# EAGLE design triac (EAGLE 8.6.0)

## Sheet 1 of 2
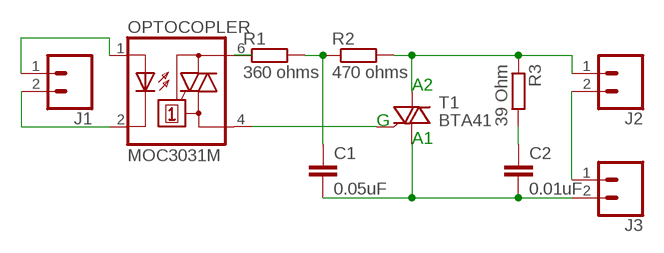
[diagram p0: schematic, sheet 1]

### Parts
C1  0.05uF  C7.5/3  [C7.5B3]
C2  0.01uF  C7.5/3  [C7.5B3]
J1  CONN_02JST-PTH-2  [JST-2-PTH]
J2  CONN_02JST-PTH-2  [JST-2-PTH]
J3  CONN_02JST-PTH-2  [JST-2-PTH]
OPTOCOPLER  MOC3031M  [DIL06]
R1  360 ohms  R-EU_0204/5  [0204/5]
R2  470 ohms  R-EU_0204/5  [0204/5]
R3  39 Ohm  R-EU_0204/5  [0204/5]
T1  BTA41  BT138-V  [TO220BV]

### Nets
N$1: J1.2 OPTOCOPLER.2(C)
N$2: J1.1 OPTOCOPLER.1(A)
N$3: OPTOCOPLER.6(A2) R1.1
N$4: C1.1 R1.2 R2.1
N$5: C1.2 C2.2 J3.2 T1.T1(A1)
N$6: OPTOCOPLER.4(A1) T1.G
N$7: J2.1 R2.2 R3.1 T1.T2(A2)
N$8: C2.1 R3.2
N$9: J2.2 J3.1

### Notes on the sheet
- A2
- G
- A1

## Sheet 2 of 2

## Library data of the parts
C1 C2 = capacitor-wima:C: CAPACITOR naming: grid - package width
J1-J3 = SparkFun-Connectors:CONN_02: Multi connection point. Often used as Generic Header-pin footprint for 0.1 inch spaced/style header connections On any of the 0.1 inch spaced packages, you can populate with these: Break Away Headers - Straight <https://www.sparkfun.com/products/116> (PRT-00116) Break Away Male Headers - Right Angle <https://www.sparkfun.com/products/553> (PRT-00553) Female Headers <https://www.sparkfun.com/products/115> (PRT-00115) Break Away Headers - Machine Pin <https://www.sparkfun.com/products/117> (PRT-00117) Break Away Female Headers - Swiss Machine Pin <https://www.sparkfun.com/products/743> (PRT-00743) For SCREWTERMINALS and SPRING TERMINALS visit here: Screw Terimnals on SparkFun.com <https://www.sparkfun.com/search/results?term=Screw+Terminals> (5mm/3.5mm/2.54mm spacing) This device is also useful as a general connection point to wire up your design to another part of your project. Our various solder wires solder well into these plated through hole pads. Hook-Up Wire - Assortment (Stranded, 22 AWG) <https://www.sparkfun.com/products/11375> (PRT-11375) Hook-Up Wire - Assortment (Solid Core, 22 AWG) <https://www.sparkfun.com/products/11367> (PRT-11367) View the entire wire category on our website here <https://www.sparkfun.com/categories/141> Special notes: Molex polarized connector foot print use with: PRT-08233 with associated crimp pins and housings. 2.54_SCREWTERM for use with PRT-10571. 3.5mm Screw Terminal footprints for PRT-08084 5mm Screw Terminal footprints for use with PRT-08432; PROD_ID: CONN-09863; SKU: PRT-09914
OPTOCOPLER = optocoupler:MOC30*: 6-Pin DIP Zero-Cross Optoisolators Triac Driver Output (250/400 Volt Peak) Source: Data sheet <http://www.fairchildsemi.com/ds/MO/MOC3031M.pdf> The old path of data sheet not more available 2013-05-06.; MF: FAIRCHILD SEMICONDUCTOR; MPN: MOC3031M; OC_FARNELL: 9875964; OC_NEWARK: 78K6089
R1-R3 = resistor:R-EU_: RESISTOR, European symbol
T1 = triac:BT138: TRIAC Source: http://www.semiconductors.philips.com BT138_SERIES_2.pdf

## Board
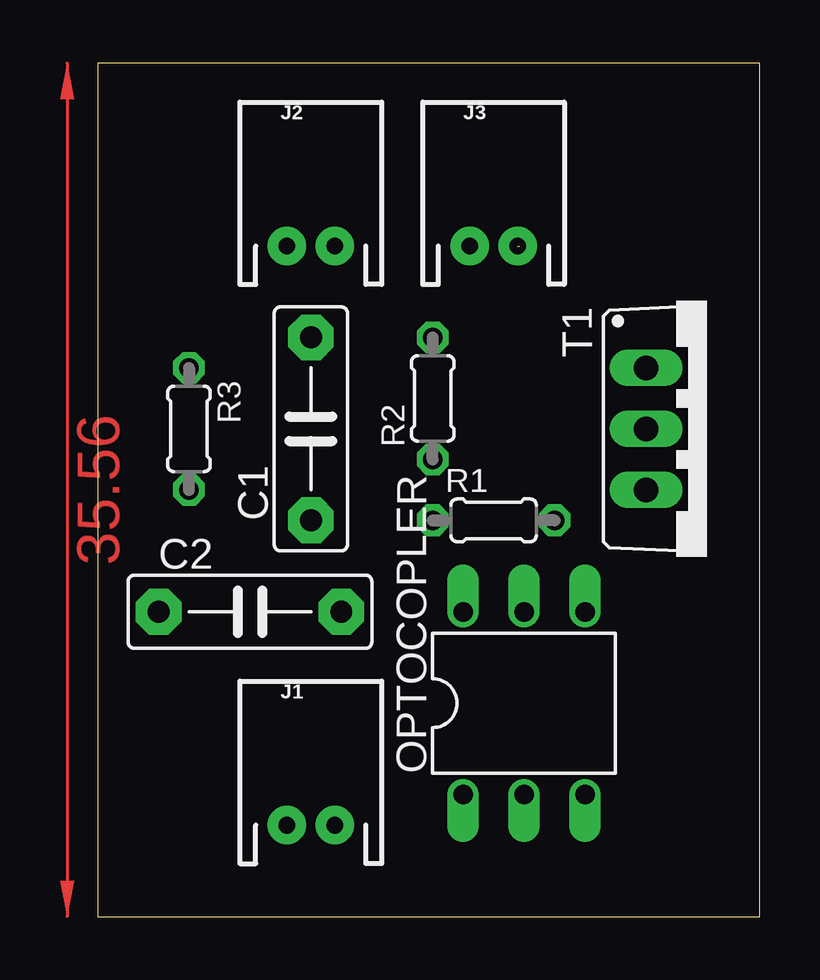
[diagram p1: board, top side]
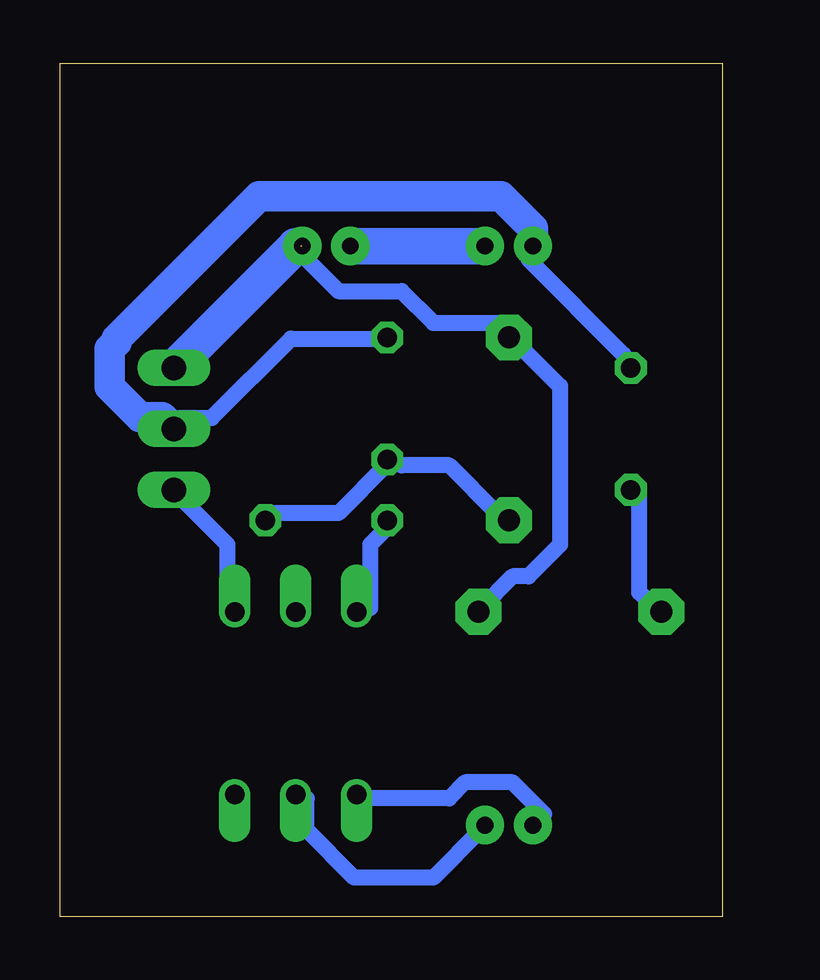
[diagram p2: board, bottom side, seen from below]

Size 27.61 x 35.55 mm. Coordinates in mm from the lower left corner, seen from the top.
Outline: 0,0 27.61,0 27.61,35.55 0,35.55 0,0
Copper layers (1*16): Top 0.035mm / dielectric 1.5mm / Bottom 0.035mm
Design rules "default *": minimum track width 26mil, minimum drill 0.35mm, track to track 26mil, track to pad 20mil, pad to pad 6mil, via to via 6mil, smd to smd 6mil, copper to edge 40mil, drill to drill 6mil, minimum pad ring 10mil, minimum via ring 8mil, stop-mask expansion 4mil, vias tented up to drill 0mil, thermal gap 10mil

### Footprints (pad centres in the part's own frame; a part is rotated, then mirrored left to right if it is on the bottom)
C7.5B3 = drill 0.914 pad 1.905 octagon: 1 -3.81,0; 2 3.81,0
JST-2-PTH = drill 0.7 pad 1.6: 1 -1,0; 2 1,0
DIL06 = drill 0.813 offset: 1 -2.54,-3.81; 2 0,-3.81; 3 2.54,-3.81; 4 2.54,3.81; 5 0,3.81; 6 -2.54,3.81
0204/5 = drill 0.813 octagon: 1 -2.54,0; 2 2.54,0
TO220BV = drill 1.016 long: G 2.54,-2.54; T1 -2.54,-2.54; T2 0,-2.54

### Placement (x,y rotation side)
C1  8.89,20.32 90 top
C2  6.35,12.7 0 top
J1  8.89,3.81 0 top
J2  8.89,27.94 0 top
J3  16.51,27.94 0 top
OPTOCOPLER  17.78,8.89 0 top
R1  16.51,16.51 0 top
R2  13.97,21.59 90 top
R3  3.81,20.32 270 top
T1  25.4,20.32 270 top

### Tracks (layer width: path | path; a pad name or v marks a point on that pad's centre or on a via)
N$1
  Bottom 0.66: OPTOCOPLER.2 17.32,4.93 17.32,3.61 15.34,1.63 12.04,1.63 10.06,3.61 J1.2
N$2
  Bottom 0.66: OPTOCOPLER.1 14.68,4.93 11.38,4.93 10.72,5.59 8.74,5.59 7.42,4.27 J1.1
N$3
  Bottom 0.66: OPTOCOPLER.6 14.68,12.85 14.68,15.49 14.02,16.15 R1.1
N$4
  Bottom 0.66: C1.1 9.4,16.82 11.38,18.8 13.36,18.8 R2.1 14.02,18.8 16,16.82 18.64,16.82 R1.2
N$5  (1 unrouted)
  Bottom 0.66: J3.2 17.32,27.38 16,26.06 13.36,26.06 12.04,24.74 9.4,24.74 C1.2 8.74,24.08 6.76,22.1 6.76,15.49 8.08,14.17 8.74,14.17 10.06,12.85 C2.2
  Bottom 1.524: T1.T1 17.78,27.94 17.58,27.94
N$6
  Bottom 0.66: OPTOCOPLER.4 20.62,12.85 20.62,15.49 22.61,17.48 T1.G
N$7
  Bottom 0.66: R3.1 4.12,23.42 8.08,27.38 J2.1 | R2.2 14.02,24.08 17.98,24.08 21.29,20.78 22.61,20.78 T1.T2 | 25.25,24.08 25.25,22.1 25.07,21.92
  Bottom 1.27: J2.1 7.89,28.69 9.22,30.02 19.3,30.02 25.25,24.08 25.25,23.93 25.53,23.65 25.53,22.07 24.26,20.8 23.34,20.8 T1.T2
N$8
  Bottom 0.66: R3.2 3.45,17.48 3.45,13.51 2.79,12.85 C2.1
N$9
  Bottom 0.66: 15.34,28.04 J3.1
  Bottom 1.27: J2.2 9.99,28.04 15.34,28.04
  Bottom 1.524: J3.1 10.16,27.94
(copper drawn outside any net)
  shapes: Top area x1